# Altium schematic sheet CoG_PRP.SchDoc
size A3; Author: Audran; CompanyName: Goldorak; Address1: Electrolab; Address2: 52 rue Paul Lescop; Address3: 92000 Nanterre; ProjectName: Cartes_2017
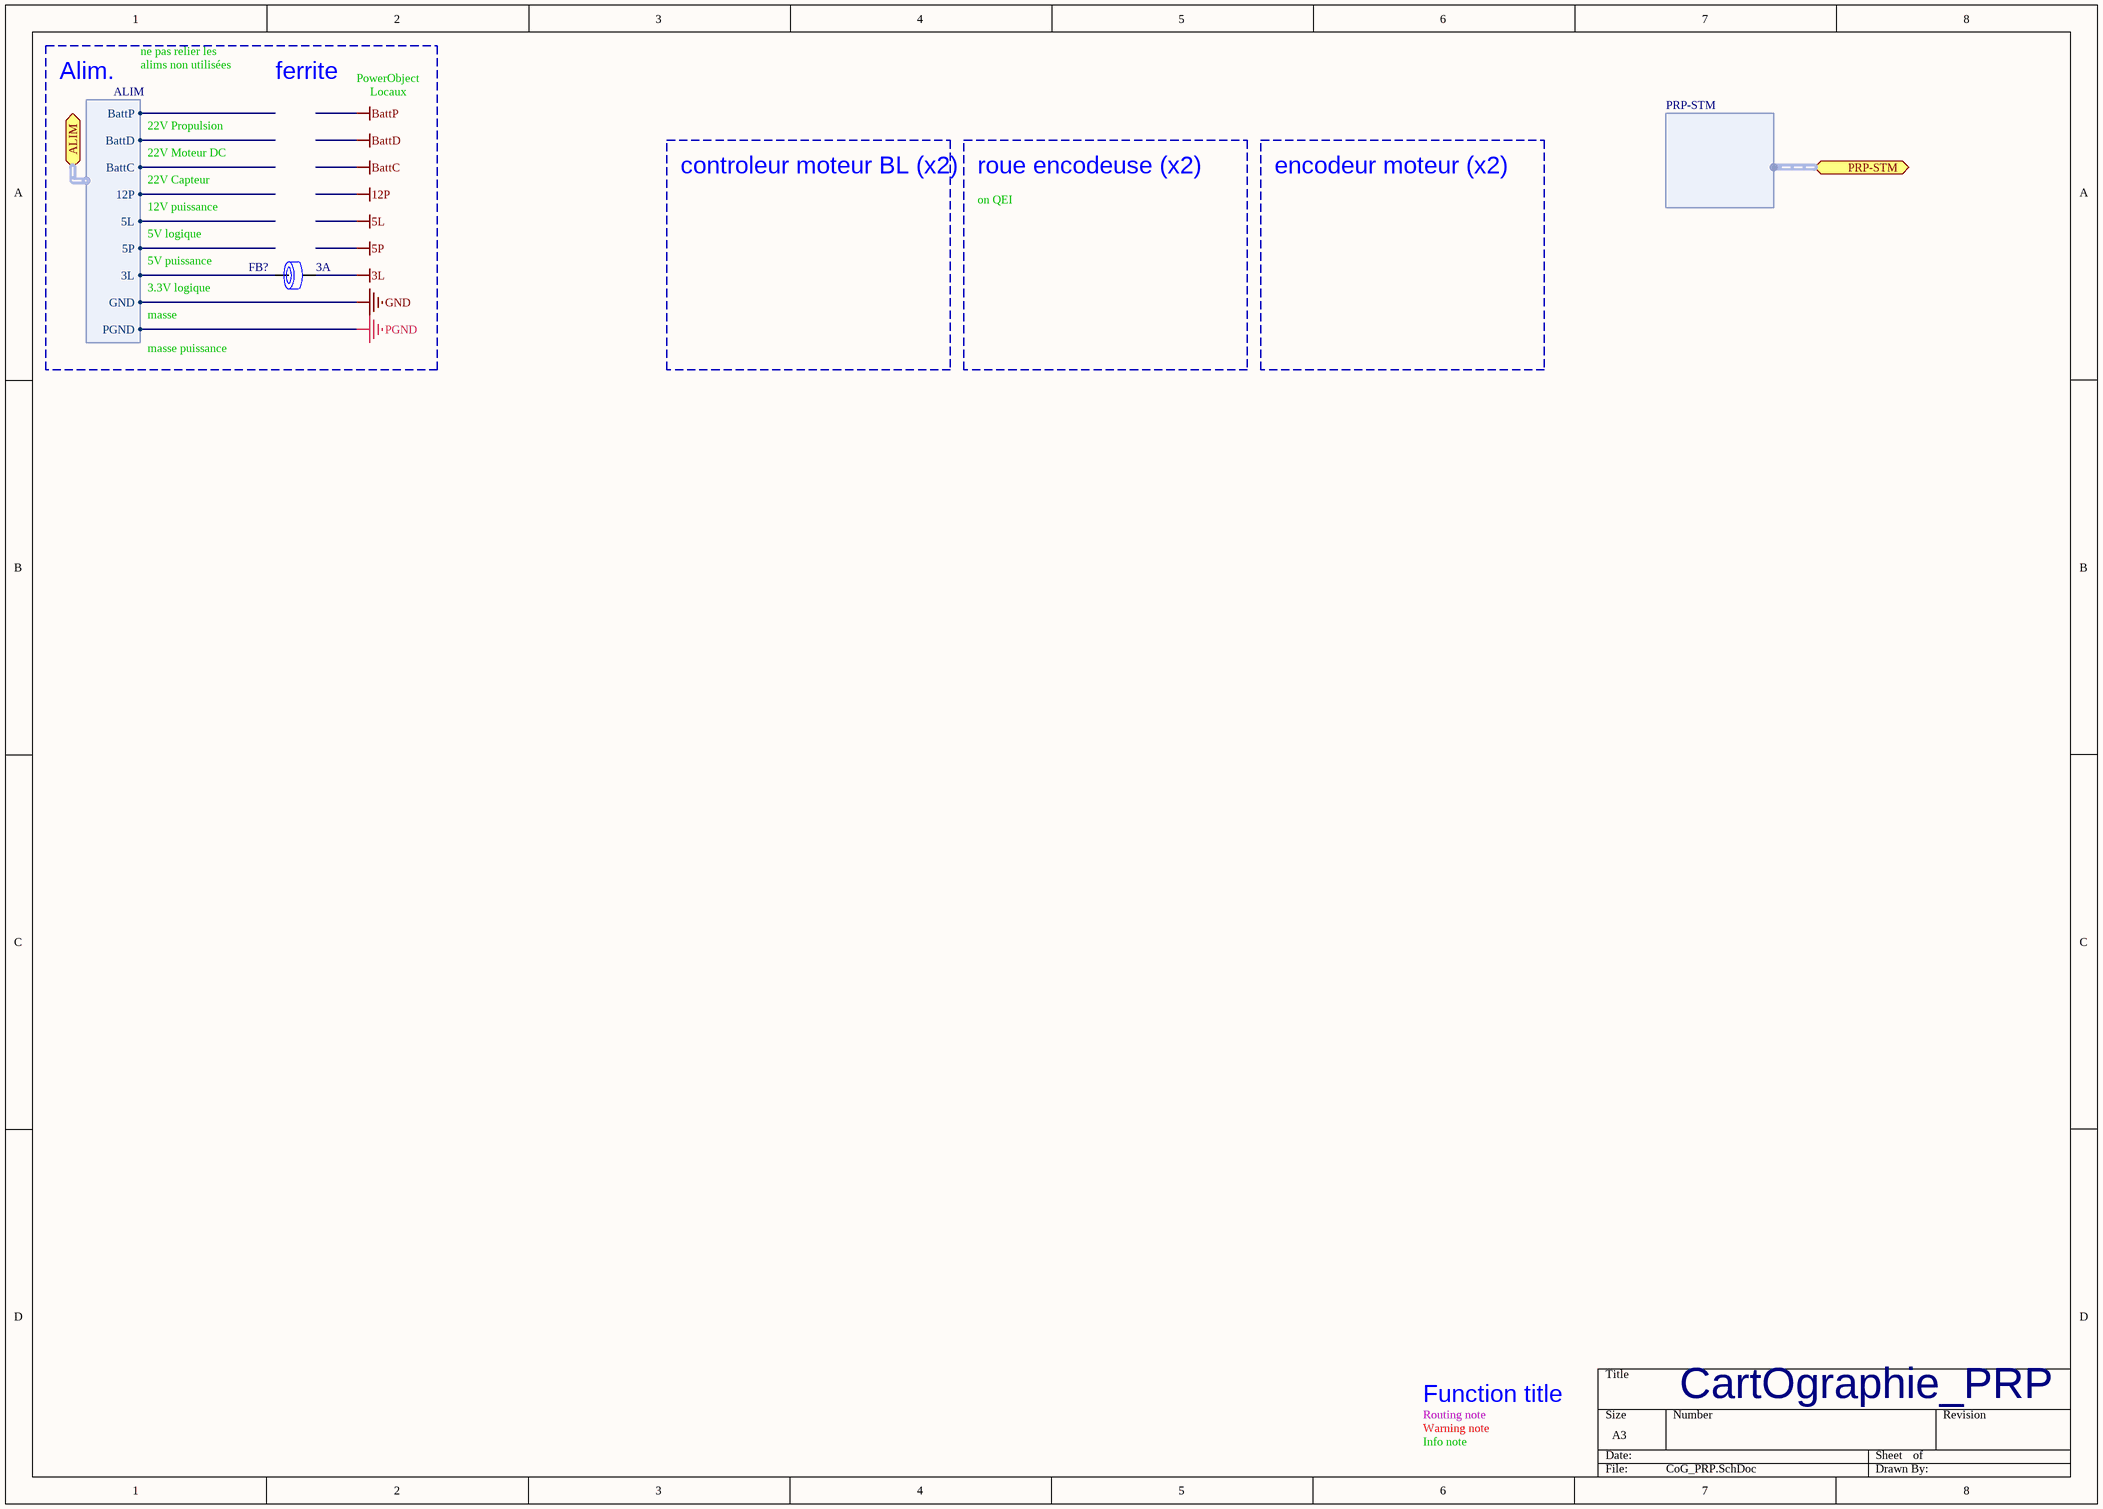
[diagram p0: CoG_PRP.SchDoc]

## Parts
FB?  RatedCurrent: 3A  [WE-CBF_0805_High Current]  (hidden comment: 742792023)

## Ports
ALIM (harness ALIM), PRP-STM (harness PRP-STM)

## Harnesses
PRP-STM: 
ALIM: BattP, BattD, BattC, 12P, 5L, 5P, 3L, GND, PGND

## Nets
3L: FB?.2
GND: port ALIM.GND
PGND: port ALIM.PGND
NetFB?_1: FB?.1 ; port ALIM.3L

## Notes on the sheet
- Alim.
- ne pas relier les
- alims non utilisées
- ferrite
- PowerObject
- Locaux
- 22V Propulsion
- 22V Moteur DC
- 22V Capteur
- controleur moteur BL (x2)
- roue encodeuse (x2)
- encodeur moteur (x2)
- 5V logique
- 12V puissance
- on QEI
- 5V puissance
- 3.3V logique
- masse
- masse puissance
- Routing note
- Warning note
- Info note
- Function title
- CartOgraphie_PRP

## Library data of the parts
FB? = WE-CBF, 742792023: Ferrite Bead 120ohm 0805 max3.0A; Manufacturer: Wurth Elektronik; Value: 120Ω; Type: High Current; PublishedDate: Aug 2016; ComponentLink1Description: Manufacturer; ComponentLink1URL: http://www.we-online.de; ComponentLink2Description: Datasheet; ComponentLink2URL: http://katalog.we-online.de/pbs/datasheet/742792023.pdf; Manufacturer Part Number: 742792023; Size: 0805